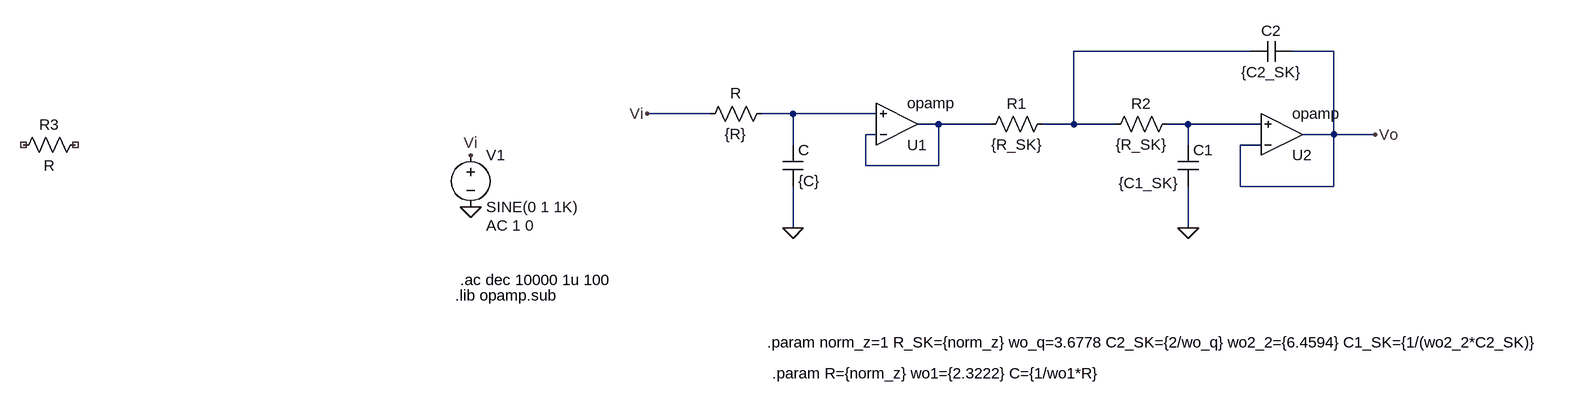
[diagram p0: schematic circuito_normalizado.asc]
circuito_normalizado.asc, the LTspice schematic file:
Version 4.1
SHEET 1 1404 680
WIRE 784 32 512 32
WIRE 912 32 848 32
WIRE -48 128 -144 128
WIRE 80 128 32 128
WIRE 208 128 80 128
WIRE 304 144 272 144
WIRE 384 144 304 144
WIRE 512 144 512 32
WIRE 512 144 464 144
WIRE 576 144 512 144
WIRE 688 144 656 144
WIRE 800 144 688 144
WIRE 208 160 192 160
WIRE 912 160 912 32
WIRE 912 160 864 160
WIRE 976 160 912 160
WIRE 80 176 80 128
WIRE 688 176 688 144
WIRE 800 176 768 176
WIRE 192 208 192 160
WIRE 304 208 304 144
WIRE 304 208 192 208
WIRE 768 240 768 176
WIRE 912 240 912 160
WIRE 912 240 768 240
WIRE 80 304 80 240
WIRE 688 304 688 240
FLAG -416 272 0
FLAG -416 192 Vi
FLAG 688 304 0
FLAG 80 304 0
FLAG -144 128 Vi
FLAG 976 160 Vo
SYMBOL res 48 112 R90
WINDOW 0 0 56 VBottom 2
WINDOW 3 32 56 VTop 2
SYMATTR InstName R
SYMATTR Value {R}
SYMBOL cap 64 176 R0
SYMATTR InstName C
SYMATTR Value {C}
SYMBOL OpAmps\\opamp 240 208 M180
SYMATTR InstName U1
SYMBOL voltage -416 176 R0
WINDOW 123 24 124 Left 2
WINDOW 39 0 0 Left 0
SYMATTR Value2 AC 1 0
SYMATTR InstName V1
SYMATTR Value SINE(0 1 1K)
SYMBOL res 480 128 R90
WINDOW 0 0 56 VBottom 2
WINDOW 3 32 56 VTop 2
SYMATTR InstName R1
SYMATTR Value {R_SK}
SYMBOL res 672 128 R90
WINDOW 0 0 56 VBottom 2
WINDOW 3 32 56 VTop 2
SYMATTR InstName R2
SYMATTR Value {R_SK}
SYMBOL cap 672 176 R0
WINDOW 3 -91 59 Left 2
SYMATTR InstName C1
SYMATTR Value {C1_SK}
SYMBOL OpAmps\\opamp 832 224 M180
SYMATTR InstName U2
SYMBOL cap 848 16 R90
WINDOW 0 0 32 VBottom 2
WINDOW 3 32 32 VTop 2
SYMATTR InstName C2
SYMATTR Value {C2_SK}
SYMBOL res -1008 160 R90
WINDOW 0 0 56 VBottom 2
WINDOW 3 32 56 VTop 2
SYMATTR InstName R3
TEXT -440 408 Left 2 !.lib opamp.sub
TEXT -432 384 Left 2 !.ac dec 10000 1u 100
TEXT 40 480 Left 2 !.param norm_z=1 R_SK={norm_z} wo_q=3.6778 C2_SK={2/wo_q} wo2_2={6.4594} C1_SK={1/(wo2_2*C2_SK)}
TEXT 48 528 Left 2 !.param R={norm_z} wo1={2.3222} C={1/wo1*R}

The netlist it stands for:
* circuito_normalizado.asc
R N002 Vi {R}
C N002 0 {C}
X§U1 N003 N002 N003 opamp Aol=100K GBW=10Meg  ; pins invin noninvin out
V1 Vi 0 SINE(0 1 1K) AC 1 0
R1 N001 N003 {R_SK}
R2 N004 N001 {R_SK}
C1 N004 0 {C1_SK}
X§U2 Vo N004 Vo opamp Aol=100K GBW=10Meg  ; pins invin noninvin out
C2 Vo N001 {C2_SK}
R3 NC_01 NC_02 R
.lib opamp.sub
.ac dec 10000 1u 100
.param norm_z=1 R_SK={norm_z} wo_q=3.6778 C2_SK={2/wo_q} wo2_2={6.4594} C1_SK={1/(wo2_2*C2_SK)}
.param R={norm_z} wo1={2.3222} C={1/wo1*R}
.backanno
.end